# Altium schematic sheet [04] EEPROM_FLASH.SchDoc
size A4
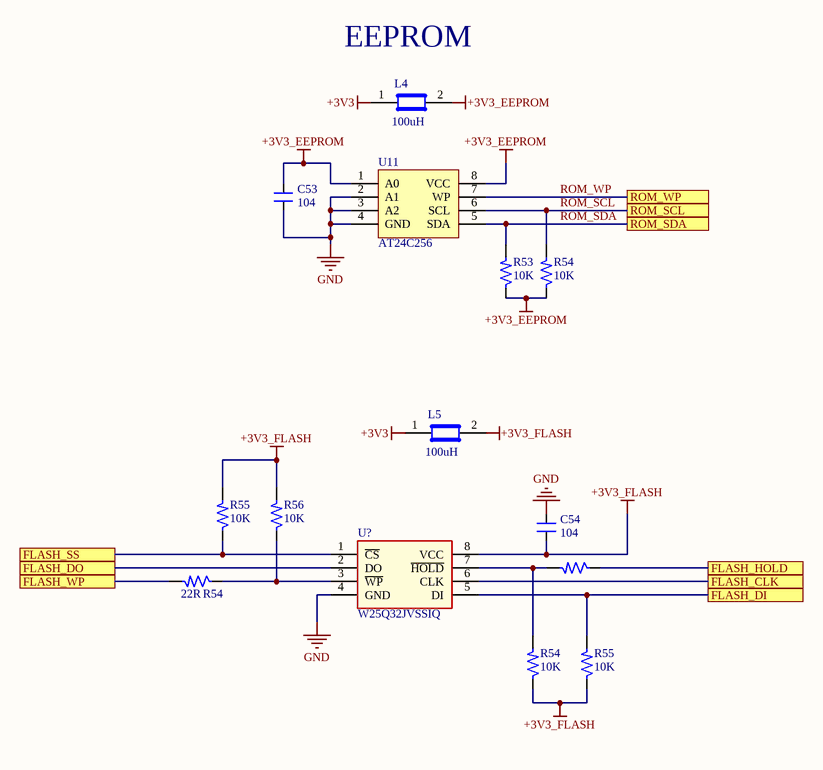
[diagram p0: [04] EEPROM_FLASH.SchDoc]

## Parts
(Parts that share a designator on the sheet are numbered #1, #2 ... from top to bottom, then left to right.)
C53  104  [C0603 SMT]
C54  104  [C0603 SMT]
L4  100uH  [R0805]
L5  100uH  [R0805]
R53  10K  [R0603 -SMT]
R54#1  10K  [R0603 -SMT]
R54#2  22R  [R0603 -SMT]
R54#3  10K  [R0603 -SMT]
R55#1  10K  [R0603 -SMT]
R55#2  22R  [R0603 -SMT]  (value not drawn)
R55#3  10K  [R0603 -SMT]
R56  10K  [R0603 -SMT]
U11  AT24C256  [SO-8]
U?  W25Q32JVSSIQ  [SO-8 208]

## Ports
FLASH_CLK, FLASH_DI, FLASH_DO, FLASH_HOLD, FLASH_SS, FLASH_WP, ROM_SCL, ROM_SDA, ROM_WP

## Nets
+3V3: L4.1 L5.1
+3V3_EEPROM: C53.2 L4.2 R53.1 R54#1.1 U11.1(A0) U11.8(VCC)
+3V3_FLASH: C54.1 L5.2 R54#3.1 R55#1.2 R55#3.1 R56.2 U?.8(VCC)
GND: C53.1 C54.2 U11.2(A1) U11.3(A2) U11.4(GND) U?.4(GND)
FLASH_CLK: U?.6(CLK) ; port FLASH_CLK
FLASH_DI: R55#3.2 U?.5(DI) ; port FLASH_DI
FLASH_DO: U?.2(DO) ; port FLASH_DO
FLASH_HOLD: R55#2.1 ; port FLASH_HOLD
FLASH_SS: R55#1.1 U?.1(~{CS}) ; port FLASH_SS
FLASH_WP: R54#2.2 ; port FLASH_WP
ROM_SCL: R54#1.2 U11.6(SCL) ; port ROM_SCL
ROM_SDA: R53.2 U11.5(SDA) ; port ROM_SDA
ROM_WP: U11.7(WP) ; port ROM_WP
NetR54#2_1: R54#2.1 R56.1 U?.3(~{WP})
NetR54#3_2: R54#3.2 R55#2.2 U?.7(~{HOLD})

## Notes on the sheet
- (near L4) EEPROM

## Library data of the parts
C53 C54 = CM: Cap SMD; Value: 103
L4 L5 = Ferrite Bead: 100uH 0805
R53 R54#1-R54#3 R55#1-R55#3 R56 = RM: Resistor SMD; Value: 1K
U11 = AT24Cxx
U? = W25Q32JV: FLASH 32MBIT 133MHZ 8SOP